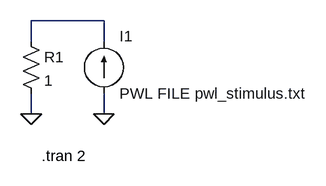
[diagram p0: schematic LlamaArch.asc]
LlamaArch.asc, the LTspice schematic file:
Version 4
SHEET 1 880 680
WIRE 304 272 304 240
WIRE 304 384 304 352
WIRE 416 240 304 240
WIRE 416 272 416 240
WIRE 416 384 416 352
FLAG 416 384 0
FLAG 304 384 0
SYMBOL current 416 352 M180
WINDOW 0 24 88 Left 0
WINDOW 3 24 0 Left 0
SYMATTR InstName I1
SYMATTR Value PWL FILE pwl_stimulus.txt
SYMBOL res 288 256 R0
SYMATTR InstName R1
SYMATTR Value 1
TEXT 320 448 Left 0 !.tran 2

The netlist it stands for:
* LlamaArch.asc
I1 0 N001 PWL FILE pwl_stimulus.txt
R1 N001 0 1
.tran 2
.backanno
.end